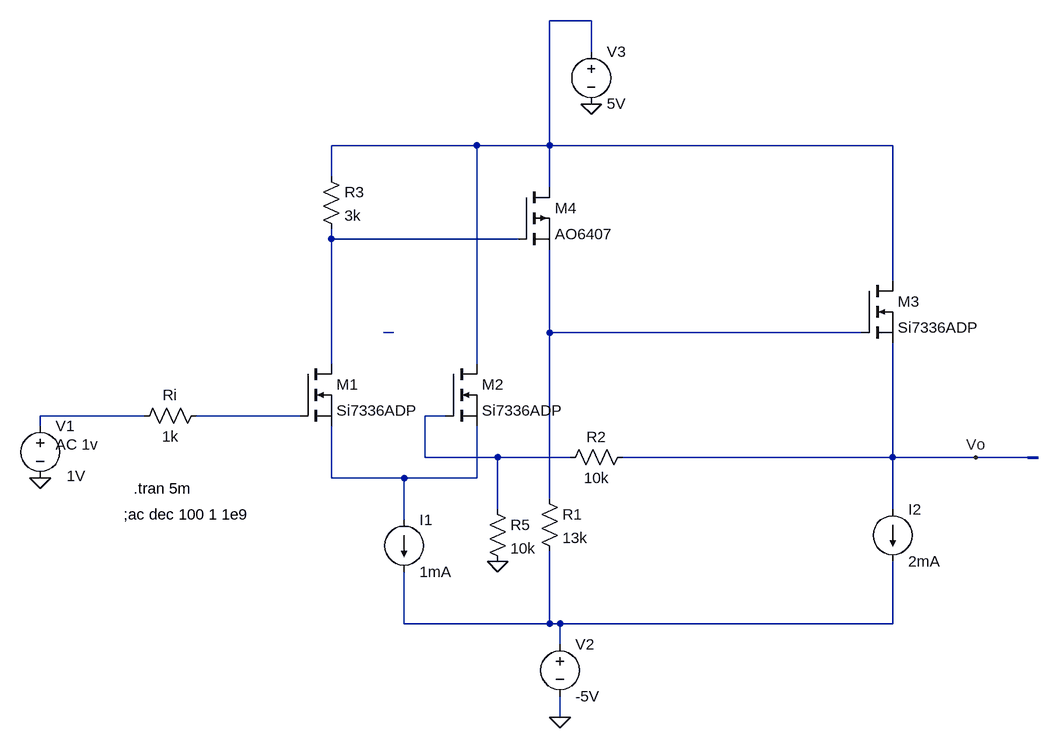
[diagram p0: schematic Example1 - 3stage_stability.asc]
Example1 - 3stage_stability.asc, the LTspice schematic file:
Version 4
SHEET 1 1440 728
WIRE 544 -384 480 -384
WIRE 544 -336 544 -384
WIRE 368 -192 144 -192
WIRE 480 -192 480 -384
WIRE 480 -192 368 -192
WIRE 1008 -192 480 -192
WIRE 144 -144 144 -192
WIRE 480 -128 480 -192
WIRE 144 -48 144 -64
WIRE 432 -48 144 -48
WIRE 1008 16 1008 -192
WIRE 240 96 224 96
WIRE 480 96 480 -32
WIRE 960 96 480 96
WIRE 144 144 144 -48
WIRE 368 144 368 -192
WIRE -144 224 -304 224
WIRE 96 224 -64 224
WIRE 320 224 288 224
WIRE -304 240 -304 224
WIRE 288 288 288 224
WIRE 400 288 288 288
WIRE 512 288 400 288
WIRE 1008 288 1008 112
WIRE 1008 288 592 288
WIRE 1136 288 1008 288
WIRE 1216 288 1136 288
WIRE 144 320 144 240
WIRE 256 320 144 320
WIRE 368 320 368 240
WIRE 368 320 256 320
WIRE 480 352 480 96
WIRE 400 368 400 288
WIRE 1008 368 1008 288
WIRE 256 384 256 320
WIRE 256 544 256 464
WIRE 480 544 480 432
WIRE 480 544 256 544
WIRE 496 544 480 544
WIRE 1008 544 1008 448
WIRE 1008 544 496 544
WIRE 496 576 496 544
WIRE 496 688 496 656
FLAG -304 320 0
FLAG 544 -256 0
FLAG 496 688 0
FLAG 1136 288 Vo
FLAG 400 448 0
BUSTAP 1216 288 1232 288
SYMBOL nmos 96 144 R0
SYMATTR InstName M1
SYMATTR Value Si7336ADP
SYMBOL nmos 320 144 R0
SYMATTR InstName M2
SYMATTR Value Si7336ADP
SYMBOL nmos 960 16 R0
SYMATTR InstName M3
SYMATTR Value Si7336ADP
SYMBOL pmos 432 -128 R0
SYMATTR InstName M4
SYMATTR Value AO6407
SYMBOL res 128 -160 R0
SYMATTR InstName R3
SYMATTR Value 3k
SYMBOL res -48 208 R90
WINDOW 0 0 56 VBottom 2
WINDOW 3 32 56 VTop 2
SYMATTR InstName Ri
SYMATTR Value 1k
SYMBOL voltage -304 224 R0
WINDOW 3 41 93 Left 2
WINDOW 123 24 44 Left 2
WINDOW 39 0 0 Left 0
SYMATTR Value 1V
SYMATTR Value2 AC 1v
SYMATTR InstName V1
SYMBOL res 464 336 R0
SYMATTR InstName R1
SYMATTR Value 13k
SYMBOL res 608 272 R90
WINDOW 0 0 56 VBottom 2
WINDOW 3 32 56 VTop 2
SYMATTR InstName R2
SYMATTR Value 10k
SYMBOL current 256 384 R0
SYMATTR InstName I1
SYMATTR Value 1mA
SYMBOL current 1008 368 R0
WINDOW 123 0 0 Left 0
WINDOW 39 0 0 Left 0
SYMATTR InstName I2
SYMATTR Value 2mA
SYMBOL voltage 496 560 R0
WINDOW 123 0 0 Left 0
WINDOW 39 0 0 Left 0
SYMATTR InstName V2
SYMATTR Value -5V
SYMBOL voltage 544 -352 R0
WINDOW 123 0 0 Left 0
WINDOW 39 0 0 Left 0
SYMATTR InstName V3
SYMATTR Value 5V
SYMBOL res 384 352 R0
SYMATTR InstName R5
SYMATTR Value 10k
TEXT -176 376 Left 2 !;ac dec 100 1 1e9
TEXT -160 336 Left 2 !.tran 5m

The netlist it stands for:
* Example1 - 3stage_stability.asc
M1 N002 N006 N008 N008 Si7336ADP
M2 N001 N007 N008 N008 Si7336ADP
M3 N001 N004 Vo Vo Si7336ADP
M4 N001 N002 N004 N004 AO6407
R3 N001 N002 3k
Ri N006 N005 1k
V1 N005 0 1V AC 1v
R1 N004 N009 13k
R2 Vo N007 10k
I1 N008 N009 1mA
I2 Vo N009 2mA
V2 N009 0 -5V
V3 N001 0 5V
R5 N007 0 10k
.model NMOS NMOS
.model PMOS PMOS
.lib standard.mos
;ac dec 100 1 1e9
.tran 5m
.backanno
.end